# Altium schematic sheet MCU.SchDoc
size 431 x 279 mm; Author: Shivam Sharma; SheetNumber: 2; SheetTotal: 13
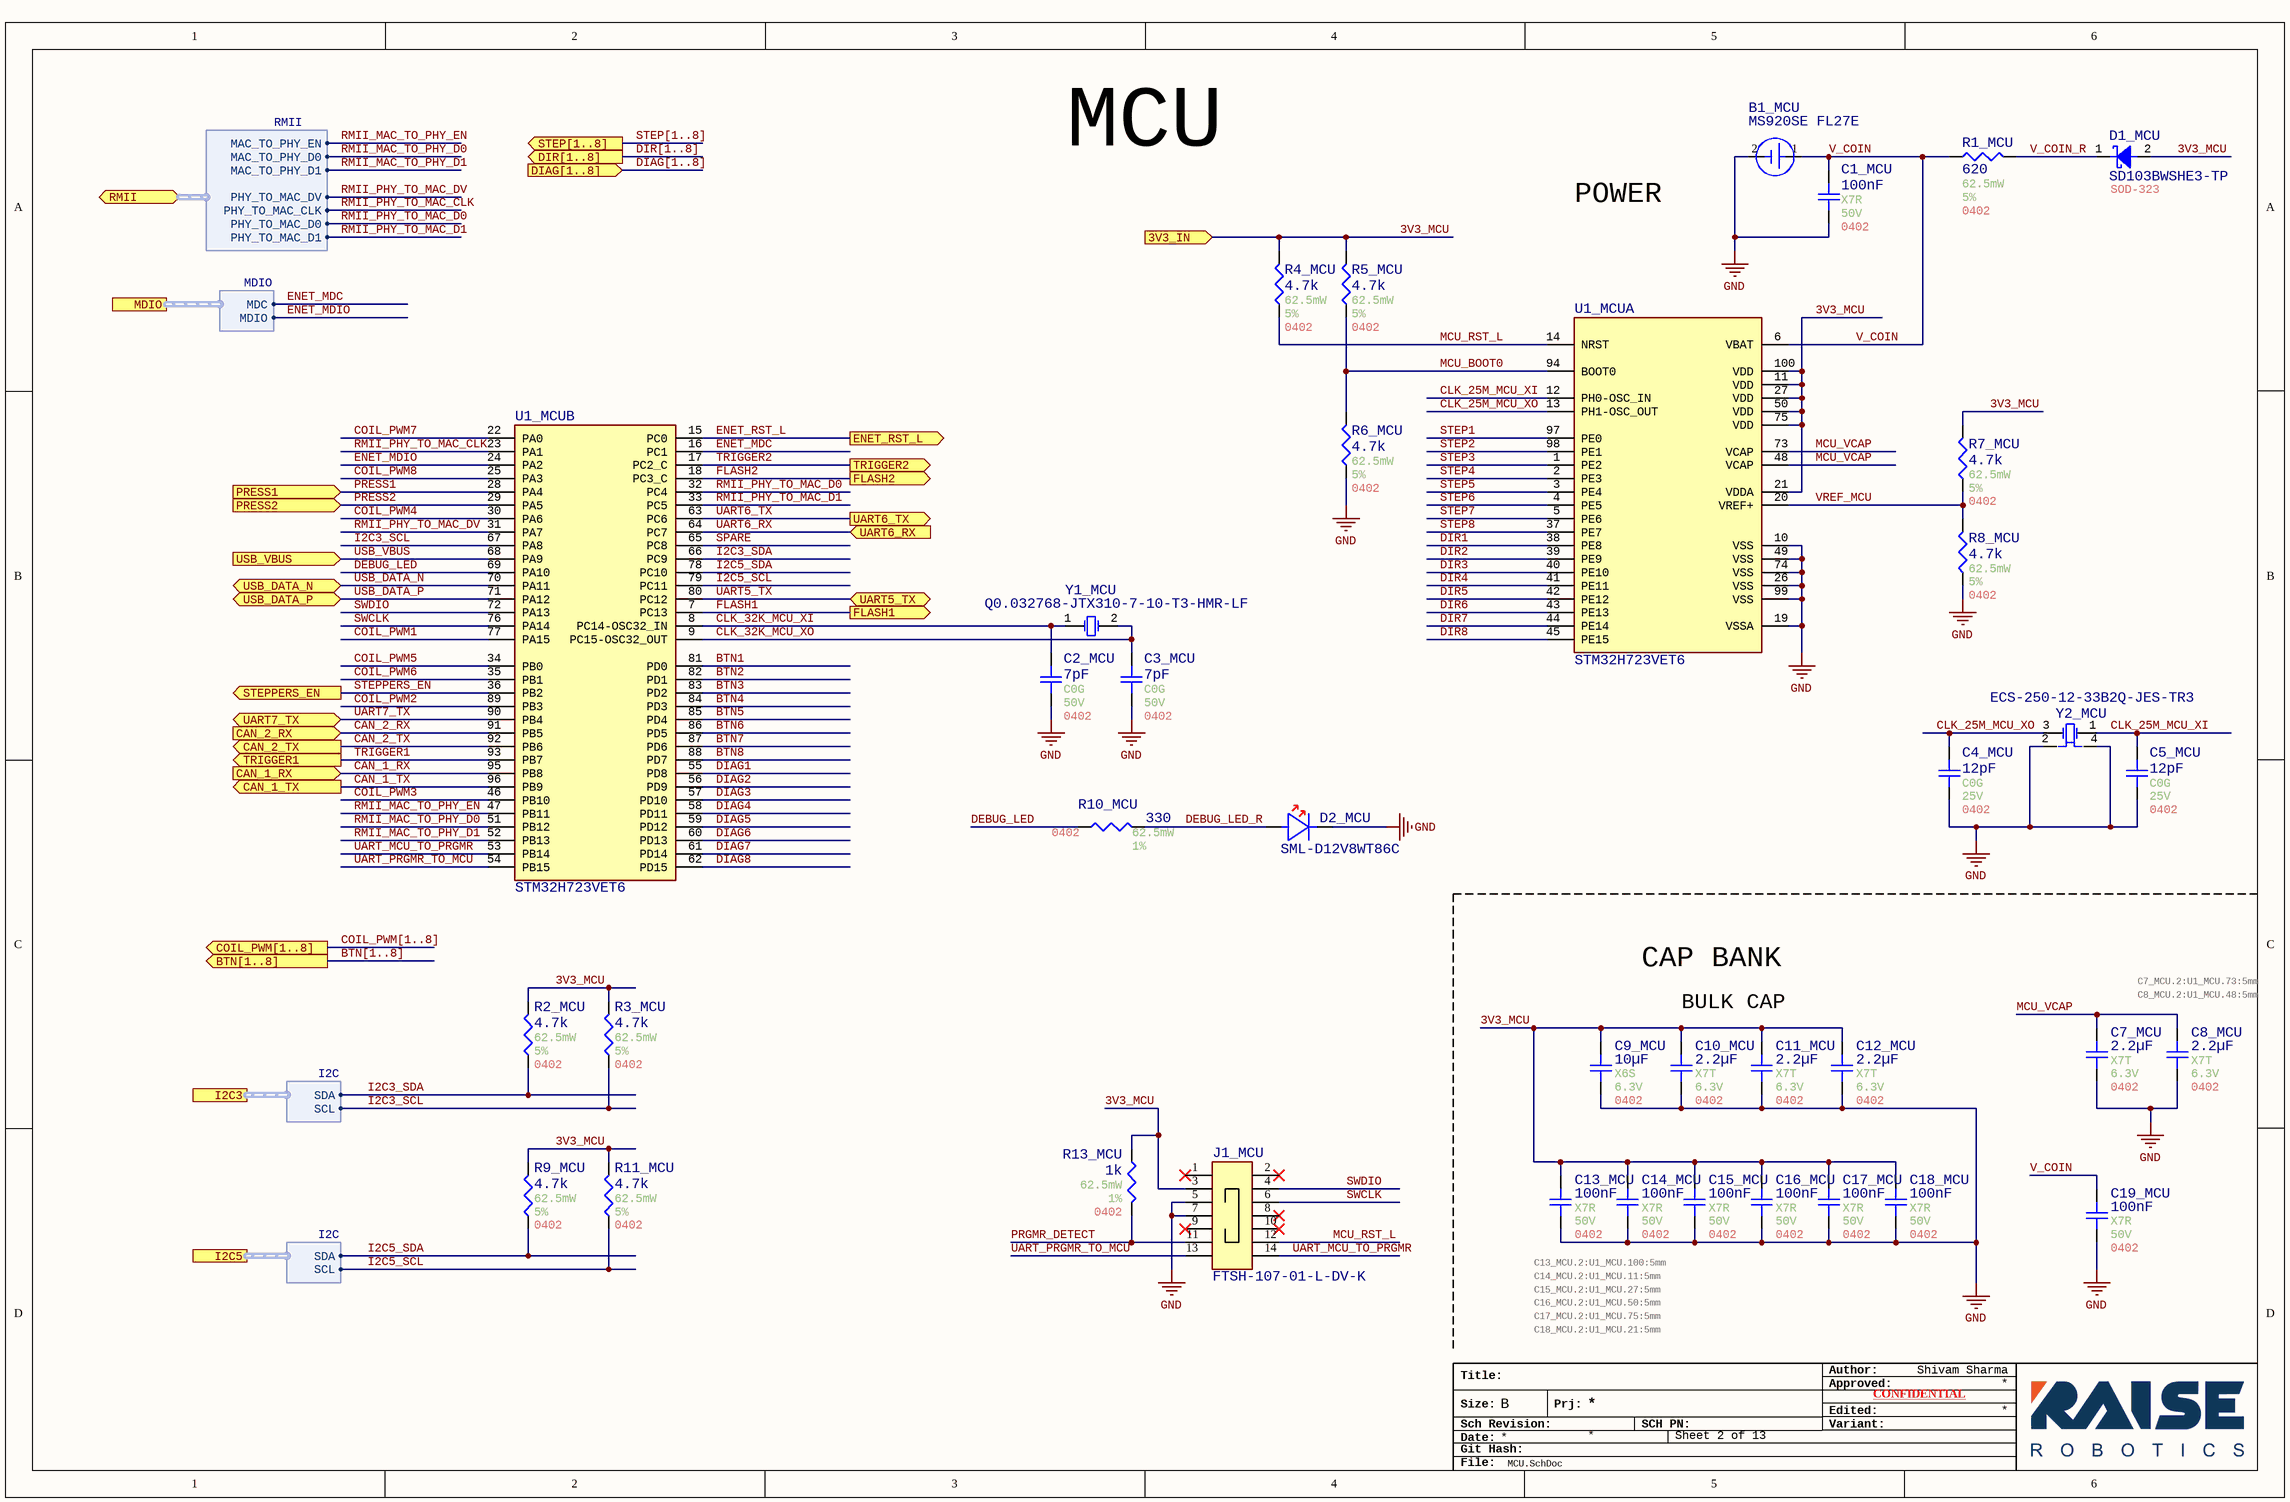
[diagram p0: MCU.SchDoc]

## Parts
B1_MCU  MS920SE FL27E  [MS920SE-FL27E]
C1_MCU  value 100nF  Temperature Coefficient: X7R  Voltage Rating: 50V  Case/Package: 0402  [Generic 0402 capacitor]  (hidden comment: GRT155R71H104KE01D)
C2_MCU  value 7pF  Temperature Coefficient: C0G  Voltage Rating: 50V  Case/Package: 0402  [Generic 0402 capacitor]  (hidden comment: GCM1555C1H7R0CA16J)
C3_MCU  value 7pF  Temperature Coefficient: C0G  Voltage Rating: 50V  Case/Package: 0402  [Generic 0402 capacitor]  (hidden comment: GCM1555C1H7R0CA16J)
C4_MCU  value 12pF  Temperature Coefficient: C0G  Voltage Rating: 25V  Case/Package: 0402  [Generic 0402 capacitor]  (hidden comment: GRT1555C1E120JA02J)
C5_MCU  value 12pF  Temperature Coefficient: C0G  Voltage Rating: 25V  Case/Package: 0402  [Generic 0402 capacitor]  (hidden comment: GRT1555C1E120JA02J)
C7_MCU  value 2.2µF  Temperature Coefficient: X7T  Voltage Rating: 6.3V  Case/Package: 0402  PlaceNear: C7_MCU.2:U1_MCU.73:5mm  [Generic 0402 capacitor]  (hidden comment: MAASJ105CD7225MFCA01)
C8_MCU  value 2.2µF  Temperature Coefficient: X7T  Voltage Rating: 6.3V  Case/Package: 0402  PlaceNear: C8_MCU.2:U1_MCU.48:5mm  [Generic 0402 capacitor]  (hidden comment: MAASJ105CD7225MFCA01)
C9_MCU  value 10µF  Temperature Coefficient: X6S  Voltage Rating: 6.3V  Case/Package: 0402  [Generic 0402 capacitor]  (hidden comment: GRT155C80J106ME13J)
C10_MCU  value 2.2µF  Temperature Coefficient: X7T  Voltage Rating: 6.3V  Case/Package: 0402  [Generic 0402 capacitor]  (hidden comment: MAASJ105CD7225MFCA01)
C11_MCU  value 2.2µF  Temperature Coefficient: X7T  Voltage Rating: 6.3V  Case/Package: 0402  [Generic 0402 capacitor]  (hidden comment: MAASJ105CD7225MFCA01)
C12_MCU  value 2.2µF  Temperature Coefficient: X7T  Voltage Rating: 6.3V  Case/Package: 0402  [Generic 0402 capacitor]  (hidden comment: MAASJ105CD7225MFCA01)
C13_MCU  value 100nF  Temperature Coefficient: X7R  Voltage Rating: 50V  Case/Package: 0402  PlaceNear: C13_MCU.2:U1_MCU.100:5mm  [Generic 0402 capacitor]  (hidden comment: GRT155R71H104KE01D)
C14_MCU  value 100nF  Temperature Coefficient: X7R  Voltage Rating: 50V  Case/Package: 0402  PlaceNear: C14_MCU.2:U1_MCU.11:5mm  [Generic 0402 capacitor]  (hidden comment: GRT155R71H104KE01D)
C15_MCU  value 100nF  Temperature Coefficient: X7R  Voltage Rating: 50V  Case/Package: 0402  PlaceNear: C15_MCU.2:U1_MCU.27:5mm  [Generic 0402 capacitor]  (hidden comment: GRT155R71H104KE01D)
C16_MCU  value 100nF  Temperature Coefficient: X7R  Voltage Rating: 50V  Case/Package: 0402  PlaceNear: C16_MCU.2:U1_MCU.50:5mm  [Generic 0402 capacitor]  (hidden comment: GRT155R71H104KE01D)
C17_MCU  value 100nF  Temperature Coefficient: X7R  Voltage Rating: 50V  Case/Package: 0402  PlaceNear: C17_MCU.2:U1_MCU.75:5mm  [Generic 0402 capacitor]  (hidden comment: GRT155R71H104KE01D)
C18_MCU  value 100nF  Temperature Coefficient: X7R  Voltage Rating: 50V  Case/Package: 0402  PlaceNear: C18_MCU.2:U1_MCU.21:5mm  [Generic 0402 capacitor]  (hidden comment: GRT155R71H104KE01D)
C19_MCU  value 100nF  Temperature Coefficient: X7R  Voltage Rating: 50V  Case/Package: 0402  [Generic 0402 capacitor]  (hidden comment: GRT155R71H104KE01D)
D1_MCU  SD103BWSHE3-TP  [SOD-323]
D2_MCU  SML-D12V8WT86C  [FP-SML-D12-MFG]
J1_MCU  FTSH-107-01-L-DV-K  [FTSH-107-01-L-DV-K-TR]
R1_MCU  value 620  Power: 62.5mW  Tolerance: 5%  Case/Package: 0402  [Generic 0402 Resistor]  (hidden comment: RC0402JR-07620RL)
R2_MCU  value 4.7k  Power: 62.5mW  Tolerance: 5%  Case/Package: 0402  [Generic 0402 Resistor]  (hidden comment: WR04X472JTL)
R3_MCU  value 4.7k  Power: 62.5mW  Tolerance: 5%  Case/Package: 0402  [Generic 0402 Resistor]  (hidden comment: WR04X472JTL)
R4_MCU  value 4.7k  Power: 62.5mW  Tolerance: 5%  Case/Package: 0402  [Generic 0402 Resistor]  (hidden comment: WR04X472JTL)
R5_MCU  value 4.7k  Power: 62.5mW  Tolerance: 5%  Case/Package: 0402  [Generic 0402 Resistor]  (hidden comment: WR04X472JTL)
R6_MCU  value 4.7k  Power: 62.5mW  Tolerance: 5%  Case/Package: 0402  [Generic 0402 Resistor]  (hidden comment: WR04X472JTL)
R7_MCU  value 4.7k  Power: 62.5mW  Tolerance: 5%  Case/Package: 0402  [Generic 0402 Resistor]  (hidden comment: WR04X472JTL)
R8_MCU  value 4.7k  Power: 62.5mW  Tolerance: 5%  Case/Package: 0402  [Generic 0402 Resistor]  (hidden comment: WR04X472JTL)
R9_MCU  value 4.7k  Power: 62.5mW  Tolerance: 5%  Case/Package: 0402  [Generic 0402 Resistor]  (hidden comment: WR04X472JTL)
R10_MCU  value 330  Power: 62.5mW  Tolerance: 1%  Case/Package: 0402  [Generic 0402 Resistor]  (hidden comment: RMCF0402FT330R)
R11_MCU  value 4.7k  Power: 62.5mW  Tolerance: 5%  Case/Package: 0402  [Generic 0402 Resistor]  (hidden comment: WR04X472JTL)
R13_MCU  value 1k  Power: 62.5mW  Tolerance: 1%  Case/Package: 0402  [Generic 0402 Resistor]  (hidden comment: WR04X1001FTL)
U1_MCU  STM32H723VET6  [STM32H723VxT]  (parts A,B of 2)
Y1_MCU  Q0.032768-JTX310-7-10-T3-HMR-LF  [JTX310]
Y2_MCU  ECS-250-12-33B2Q-JES-TR3  [ECS-250-12-33B2Q-JES-TR3]

## Ports
3V3_IN (in), BTN[1..8] (out), CAN_1_RX (in), CAN_1_TX (out), CAN_2_RX (in), CAN_2_TX (out), COIL_PWM[1..8] (out), DIAG[1..8] (in), DIR[1..8] (out), ENET_RST_L (out), FLASH1 (out), FLASH2 (out), I2C3 (harness I2C), I2C5 (harness I2C), MDIO (harness MDIO), PRESS1 (in), PRESS2 (in), RMII (bidir, harness RMII), STEP[1..8] (out), STEPPERS_EN (out), TRIGGER1 (out), TRIGGER2 (out), UART5_TX (bidir), UART6_RX (in), UART6_TX (out), UART7_TX (bidir), USB_DATA_N (bidir), USB_DATA_P (bidir), USB_VBUS (in)

## Harnesses
RMII: MAC_TO_PHY_D0, MAC_TO_PHY_D1, PHY_TO_MAC_D0, PHY_TO_MAC_CLK, PHY_TO_MAC_D1, MAC_TO_PHY_EN, PHY_TO_MAC_DV
MDIO: MDIO, MDC
I2C: SDA, SCL

## Nets
GND: B1_MCU.2 C1_MCU.1 C2_MCU.1 C3_MCU.1 C4_MCU.1 C5_MCU.1 C7_MCU.1 C8_MCU.1 C9_MCU.1 C10_MCU.1 C11_MCU.1 C12_MCU.1 C13_MCU.1 C14_MCU.1 C15_MCU.1 C16_MCU.1 C17_MCU.1 C18_MCU.1 C19_MCU.1 D2_MCU.1(C) J1_MCU.5 J1_MCU.7 R6_MCU.1 R8_MCU.1 U1_MCU.10(VSS) U1_MCU.19(VSSA) U1_MCU.26(VSS) U1_MCU.49(VSS) U1_MCU.74(VSS) U1_MCU.99(VSS) Y2_MCU.2 Y2_MCU.4
3V3_MCU: C9_MCU.2 C10_MCU.2 C11_MCU.2 C12_MCU.2 C13_MCU.2 C14_MCU.2 C15_MCU.2 C16_MCU.2 C17_MCU.2 C18_MCU.2 D1_MCU.2(A) J1_MCU.3 R2_MCU.2 R3_MCU.2 R4_MCU.2 R5_MCU.2 R7_MCU.2 R9_MCU.2 R11_MCU.2 R13_MCU.2 U1_MCU.11(VDD) U1_MCU.21(VDDA) U1_MCU.27(VDD) U1_MCU.50(VDD) U1_MCU.75(VDD) U1_MCU.100(VDD) ; port 3V3_IN
BTN1: U1_MCU.81(PD0)
BTN2: U1_MCU.82(PD1)
BTN3: U1_MCU.83(PD2)
BTN4: U1_MCU.84(PD3)
BTN5: U1_MCU.85(PD4)
BTN6: U1_MCU.86(PD5)
BTN7: U1_MCU.87(PD6)
BTN8: U1_MCU.88(PD7)
CAN_1_RX: U1_MCU.95(PB8) ; port CAN_1_RX
CAN_1_TX: U1_MCU.96(PB9) ; port CAN_1_TX
CAN_2_RX: U1_MCU.91(PB5) ; port CAN_2_RX
CAN_2_TX: U1_MCU.92(PB6) ; port CAN_2_TX
CLK_25M_MCU_XI: C5_MCU.2 U1_MCU.12(PH0-OSC_IN) Y2_MCU.1
CLK_25M_MCU_XO: C4_MCU.2 U1_MCU.13(PH1-OSC_OUT) Y2_MCU.3
CLK_32K_MCU_XI: C2_MCU.2 U1_MCU.8(PC14-OSC32_IN) Y1_MCU.1
CLK_32K_MCU_XO: C3_MCU.2 U1_MCU.9(PC15-OSC32_OUT) Y1_MCU.2
COIL_PWM1: U1_MCU.77(PA15)
COIL_PWM2: U1_MCU.89(PB3)
COIL_PWM3: U1_MCU.46(PB10)
COIL_PWM4: U1_MCU.30(PA6)
COIL_PWM5: U1_MCU.34(PB0)
COIL_PWM6: U1_MCU.35(PB1)
COIL_PWM7: U1_MCU.22(PA0)
COIL_PWM8: U1_MCU.25(PA3)
DEBUG_LED: R10_MCU.1 U1_MCU.69(PA10)
DEBUG_LED_R: D2_MCU.2(A) R10_MCU.2
DIAG1: U1_MCU.55(PD8)
DIAG2: U1_MCU.56(PD9)
DIAG3: U1_MCU.57(PD10)
DIAG4: U1_MCU.58(PD11)
DIAG5: U1_MCU.59(PD12)
DIAG6: U1_MCU.60(PD13)
DIAG7: U1_MCU.61(PD14)
DIAG8: U1_MCU.62(PD15)
DIR1: U1_MCU.38(PE8)
DIR2: U1_MCU.39(PE9)
DIR3: U1_MCU.40(PE10)
DIR4: U1_MCU.41(PE11)
DIR5: U1_MCU.42(PE12)
DIR6: U1_MCU.43(PE13)
DIR7: U1_MCU.44(PE14)
DIR8: U1_MCU.45(PE15)
ENET_MDC: U1_MCU.16(PC1) ; port MDIO.MDC
ENET_MDIO: U1_MCU.24(PA2) ; port MDIO.MDIO
ENET_RST_L: U1_MCU.15(PC0) ; port ENET_RST_L
FLASH1: U1_MCU.7(PC13) ; port FLASH1
FLASH2: U1_MCU.18(PC3_C) ; port FLASH2
I2C3_SCL: R3_MCU.1 U1_MCU.67(PA8) ; port I2C3.SCL
I2C3_SDA: R2_MCU.1 U1_MCU.66(PC9) ; port I2C3.SDA
I2C5_SCL: R11_MCU.1 U1_MCU.79(PC11) ; port I2C5.SCL
I2C5_SDA: R9_MCU.1 U1_MCU.78(PC10) ; port I2C5.SDA
MCU_BOOT0: R5_MCU.1 R6_MCU.2 U1_MCU.94(BOOT0)
MCU_RST_L: J1_MCU.12 R4_MCU.1 U1_MCU.14(NRST)
MCU_VCAP: C7_MCU.2 C8_MCU.2 U1_MCU.48(VCAP) U1_MCU.73(VCAP)
PRESS1: U1_MCU.28(PA4) ; port PRESS1
PRESS2: U1_MCU.29(PA5) ; port PRESS2
PRGMR_DETECT: J1_MCU.11 R13_MCU.1
RMII_MAC_TO_PHY_D0: U1_MCU.51(PB12) ; port RMII.MAC_TO_PHY_D0
RMII_MAC_TO_PHY_D1: U1_MCU.52(PB13) ; port RMII.MAC_TO_PHY_D1
RMII_MAC_TO_PHY_EN: U1_MCU.47(PB11) ; port RMII.MAC_TO_PHY_EN
RMII_PHY_TO_MAC_CLK: U1_MCU.23(PA1) ; port RMII.PHY_TO_MAC_CLK
RMII_PHY_TO_MAC_D0: U1_MCU.32(PC4) ; port RMII.PHY_TO_MAC_D0
RMII_PHY_TO_MAC_D1: U1_MCU.33(PC5) ; port RMII.PHY_TO_MAC_D1
RMII_PHY_TO_MAC_DV: U1_MCU.31(PA7) ; port RMII.PHY_TO_MAC_DV
SPARE: U1_MCU.65(PC8)
STEP1: U1_MCU.97(PE0)
STEP2: U1_MCU.98(PE1)
STEP3: U1_MCU.1(PE2)
STEP4: U1_MCU.2(PE3)
STEP5: U1_MCU.3(PE4)
STEP6: U1_MCU.4(PE5)
STEP7: U1_MCU.5(PE6)
STEP8: U1_MCU.37(PE7)
STEPPERS_EN: U1_MCU.36(PB2) ; port STEPPERS_EN
SWCLK: J1_MCU.6 U1_MCU.76(PA14)
SWDIO: J1_MCU.4 U1_MCU.72(PA13)
TRIGGER1: U1_MCU.93(PB7) ; port TRIGGER1
TRIGGER2: U1_MCU.17(PC2_C) ; port TRIGGER2
UART5_TX: U1_MCU.80(PC12) ; port UART5_TX
UART6_RX: U1_MCU.64(PC7) ; port UART6_RX
UART6_TX: U1_MCU.63(PC6) ; port UART6_TX
UART7_TX: U1_MCU.90(PB4) ; port UART7_TX
UART_MCU_TO_PRGMR: J1_MCU.14 U1_MCU.53(PB14)
UART_PRGMR_TO_MCU: J1_MCU.13 U1_MCU.54(PB15)
USB_DATA_N: U1_MCU.70(PA11) ; port USB_DATA_N
USB_DATA_P: U1_MCU.71(PA12) ; port USB_DATA_P
USB_VBUS: U1_MCU.68(PA9) ; port USB_VBUS
V_COIN: B1_MCU.1 C1_MCU.2 C19_MCU.2 R1_MCU.1 U1_MCU.6(VBAT)
V_COIN_R: D1_MCU.1(C) R1_MCU.2
VREF_MCU: R7_MCU.1 R8_MCU.2 U1_MCU.20(VREF+)

Not connected (* = marked no-connect by the designer): J1_MCU 1* 2* 8* 9* 10*

## Buses and harness runs
bus BTN[1..8] = port BTN[1..8]
bus COIL_PWM[1..8] = port COIL_PWM[1..8]
bus DIAG[1..8] = port DIAG[1..8]
bus DIR[1..8] = port DIR[1..8]
bus STEP[1..8] = port STEP[1..8]

## Notes on the sheet
- MCU
- POWER
- CAP BANK
- BULK CAP
- Title:
- Author:
- Approved:
- Size:
- Date:
- Git Hash:
- Sch Revision:
- B
- Prj:
- SCH PN:
- Variant:
- Edited:
- CONFIDENTIAL
- File:

## Library data of the parts
B1_MCU = CMP-00029-00001-1: Secondary Battery, Manganese Silicon Lithium, 3V, 0.011Ah; Pins: 2; RoHS Compliant: Yes; Voltage Rating: 3V
C1_MCU C13_MCU C14_MCU C15_MCU C16_MCU C17_MCU C18_MCU C19_MCU = CMP-001-00084-12: Ceramic Capacitor, Multilayer, Ceramic, 50V, 10% +Tol, 10% -Tol, X7R, 15% TC, 0.1uF, Surface Mount, 0402; AECQ: Yes; Reach SVHC Compliant: Yes; Mounting Technology: Surface Mount; Termination: Wraparound; Pins: 2; Packaging: Tape and Reel; Package Shape: Rectangular; Multilayer: Yes; Tolerance: 10%; Max Operating Temperature: 125°C; Terminal Finish: Nickel; Capacitor Type: Ceramic; Dielectric Material: Ceramic; Min Operating Temperature: -55°C; RoHS Compliant: Yes
C2_MCU C3_MCU = CMP-001-00111-2: Ceramic Capacitor, Multilayer, Ceramic, 50V, 3.57% +Tol, 3.57% -Tol, C0G, 30ppm/Cel TC, 0.000007uF, Surface Mount, 0402; AECQ: Yes; Tolerance: 3.5%; Mounting Technology: Surface Mount; Pins: 2; Min Operating Temperature: -55°C; Max Operating Temperature: 125°C; Capacitor Type: Ceramic; RoHS Compliant: Yes
C4_MCU C5_MCU = CMP-001-00109-2: Ceramic Capacitor, Multilayer, Ceramic, 25V, 5% +Tol, 5% -Tol, C0G, 30ppm/Cel TC, 0.000012uF, Surface Mount, 0402; AECQ: Yes; Pins: 2; Mounting Technology: Surface Mount; Min Operating Temperature: -55°C; RoHS Compliant: Yes; Max Operating Temperature: 125°C; Tolerance: 5%; Capacitor Type: Ceramic
C7_MCU C8_MCU C10_MCU C11_MCU C12_MCU = CMP-001-00096-4: Mlcc, 2.2 Uf, # 20 %, 0402, 6.3V, X7T, T&r Q200; Tolerance: 20%; Capacitor Type: Ceramic; AECQ: Yes; Mounting Technology: SMD; Pins: 2; Max Operating Temperature: 125°C; Min Operating Temperature: -55°C
C9_MCU = CMP-001-00108-2: Multilayer Ceramic Capacitors MLCC - SMD/SMT 0402 10uF 6.3VDC 20% X6S AEC-Q200; AECQ: Yes; Mounting Technology: Surface Mount; Max Operating Temperature: 105°C; Min Operating Temperature: -55°C; Tolerance: 20%; Pins: 2; RoHS Compliant: Yes; Capacitor Type: Ceramic
D1_MCU = CMP-004-00038-1: Rectifier Diode, Schottky, 1 Phase, 1 Element, 0.35A, 30V V(RRM), Silicon; Reverse Recovery Time: 10ns; Forward Voltage: 370mV; Forward Current: 350mA; Min Operating Temperature: -55°C; Max Operating Temperature: 125°C; RoHS Compliant: Yes; Min Breakdown Voltage: 30V; Max Output current: 350mA; Case/Package: SOD-323; Pins: 2
D2_MCU = CMP-007-00036-1: Red 630nm LED Indication - Discrete 2.2V 0603 (1608 Metric); Case/Package: 0603; Forward Voltage: 2.2V; Colour: Red; Pins: 2
J1_MCU = CMP-002-00103-1: Board Connector, 14 Contact(s), 2 Row(s), Male, Straight, 0.05 inch Pitch, Surface Mount Terminal, Locking, Receptacle; Manufacturer: Samtec; Manufacturer Series: FTSH; Filter Feature: No; Number of Contacts: 14; Plating Thickness: 10uin; Number Of Connectors: 1; Contact Pattern: RECTANGULAR; Body Length: 0.35inch; Mating Information: MULTIPLE MATING PARTS AVAILABLE; PCB Contact Row Spacing: 4.064mm; Reference Standard: UL; Number Of PCB Rows: 2; Option: General Purpose; Body Breadth: 0.135inch; Max Current Rating: 3.4A; Reliability: COMMERCIAL; Contact Style: SQ PIN-SKT; Body/Shell Style: RECEPTACLE; Mounting Style: STRAIGHT; Contact Material: Bronze; Terminal Pitch: 1.27mm; Termination: SMD/SMT; Reach SVHC Compliant: Yes; IEC Conformance: No; Connector Type: BOARD CONNECTOR; MIL Conformance: No; RoHS Compliant: Yes; PCB Contact Pattern: RECTANGULAR; Flammability Rating: UL94 V-0; Gender: Male; Mating Contact Pitch: 0.05inch; Insulation Material: Polymer; Number of Rows Loaded: 2; Contact Finish - Mating: GOLD (10) OVER NICKEL (50); Mating Contact Row Spacing: 0.05inch; DIN Conformance: No; Pins: 14; Mounting Option 1: LOCKING; Contact Finish - Termination: Tin (Sn) - with Nickel (Ni) barrier; JESD-609 Code: e3; Contact Gender: Male; Mixed Contacts: No; Mounting Technology: Board
R1_MCU = CMP-009-00209-4: Fixed Resistor, Metal Glaze/thick Film, 0.0625W, 620ohm, 50V, 5% +/-Tol, 100ppm/Cel, Surface Mount, 0402; AECQ: No; RoHS Compliant: Yes; Min Operating Temperature: -55°C; Max Operating Temperature: 155°C; Pins: 2; Mounting Technology: Surface Mount
R2_MCU R3_MCU R4_MCU R5_MCU R6_MCU R7_MCU R8_MCU R9_MCU R11_MCU = CMP-009-00184-8: Fixed Resistor, Metal Glaze/thick Film, 0.0625W, 4700ohm, 50V, 5% +/-Tol, 100ppm/Cel, Surface Mount, 0402; Manufacturer Part Number: Blank; Package Height: 0.35mm; Package Length: 1mm; Rated Temperature: 70°C; Package Width: 0.5mm; AECQ: No; Temperature Coefficient (ppm/Cel): 200; Additional Feature: LASER TRIMMABLE; Mounting Technology: Surface Mount; Technology: METAL GLAZE/THICK FILM; RoHS Compliant: Yes; Resistor Type: FIXED RESISTOR; Package Shape: Rectangular; Pins: 2; Construction: Chip; Terminal Finish: Nickel; Max Operating Temperature: 155°C; Working Voltage: 50V; Packaging: Tape and Reel; Termination: Wraparound; JESD-609 Code: e3; Reach SVHC Compliant: Yes; Min Operating Temperature: -55°C
R10_MCU = CMP-009-00225-1: Res Thick Film 0402 330 Ohm 1% 0.063W ±100ppm/°C Molded SMD Paper T/R; AECQ: Yes; Mounting Technology: Surface Mount; Max Operating Temperature: 155°C; RoHS Compliant: Yes; Pins: 2; Min Operating Temperature: -55°C
R13_MCU = CMP-009-00182-8: Fixed Resistor, Metal Glaze/thick Film, 0.0625W, 1000ohm, 50V, 1% +/-Tol, 100ppm/Cel, Surface Mount, 0402; Manufacturer Part Number: Blank; Package Width: 0.5mm; Rated Temperature: 70°C; AECQ: No; Package Length: 1mm; Additional Feature: LASER TRIMMABLE; Package Height: 0.35mm; Temperature Coefficient (ppm/Cel): 100; RoHS Compliant: Yes; Working Voltage: 50V; Min Operating Temperature: -55°C; Pins: 2; Reach SVHC Compliant: Yes; Technology: METAL GLAZE/THICK FILM; Terminal Finish: Nickel; Max Operating Temperature: 155°C; Resistor Type: FIXED RESISTOR; Package Shape: Rectangular; Mounting Technology: Surface Mount; Termination: Wraparound; JESD-609 Code: e3; Packaging: Tape and Reel; Construction: Chip
U1_MCU = CMP-020-00028-1: MCU 32-bit ARM Cortex M7 RISC 512KB Flash 1.8V/2.5V/3.3V 100-Pin LQFP Tray; Frequency: 550MHz; Min Operating Temperature: -40°C; Max Operating Temperature: 85°C; Case/Package: 100-LQFP (14x14); RoHS Compliant: Yes; PartId: 1
Y1_MCU = CMP-003-00031-2: Parallel - Fundamental Quartz Crystal, 0.032768MHz Nom; Frequency: 32.769kHz; Load Capacitance: 7pF; ESR: 80k; Min Operating Temperature: -40°C; Max Operating Temperature: 125°C; Case/Package: 3.2.x1.5; Pins: 2; RoHS Compliant: Yes
Y2_MCU = CMP-003-00030-1: Crystal 25.000 Mhz 12PF SMD; AECQ: Yes; ESR: 50; Frequency: 25MHz; Mounting Technology: SMD; Min Operating Temperature: -40°C; Case/Package: 3.2x2.5; Load Capacitance: 12pF; Pins: 4; Max Operating Temperature: 125°C